# EAGLE design 124_micamp (EAGLE 9.6.2)
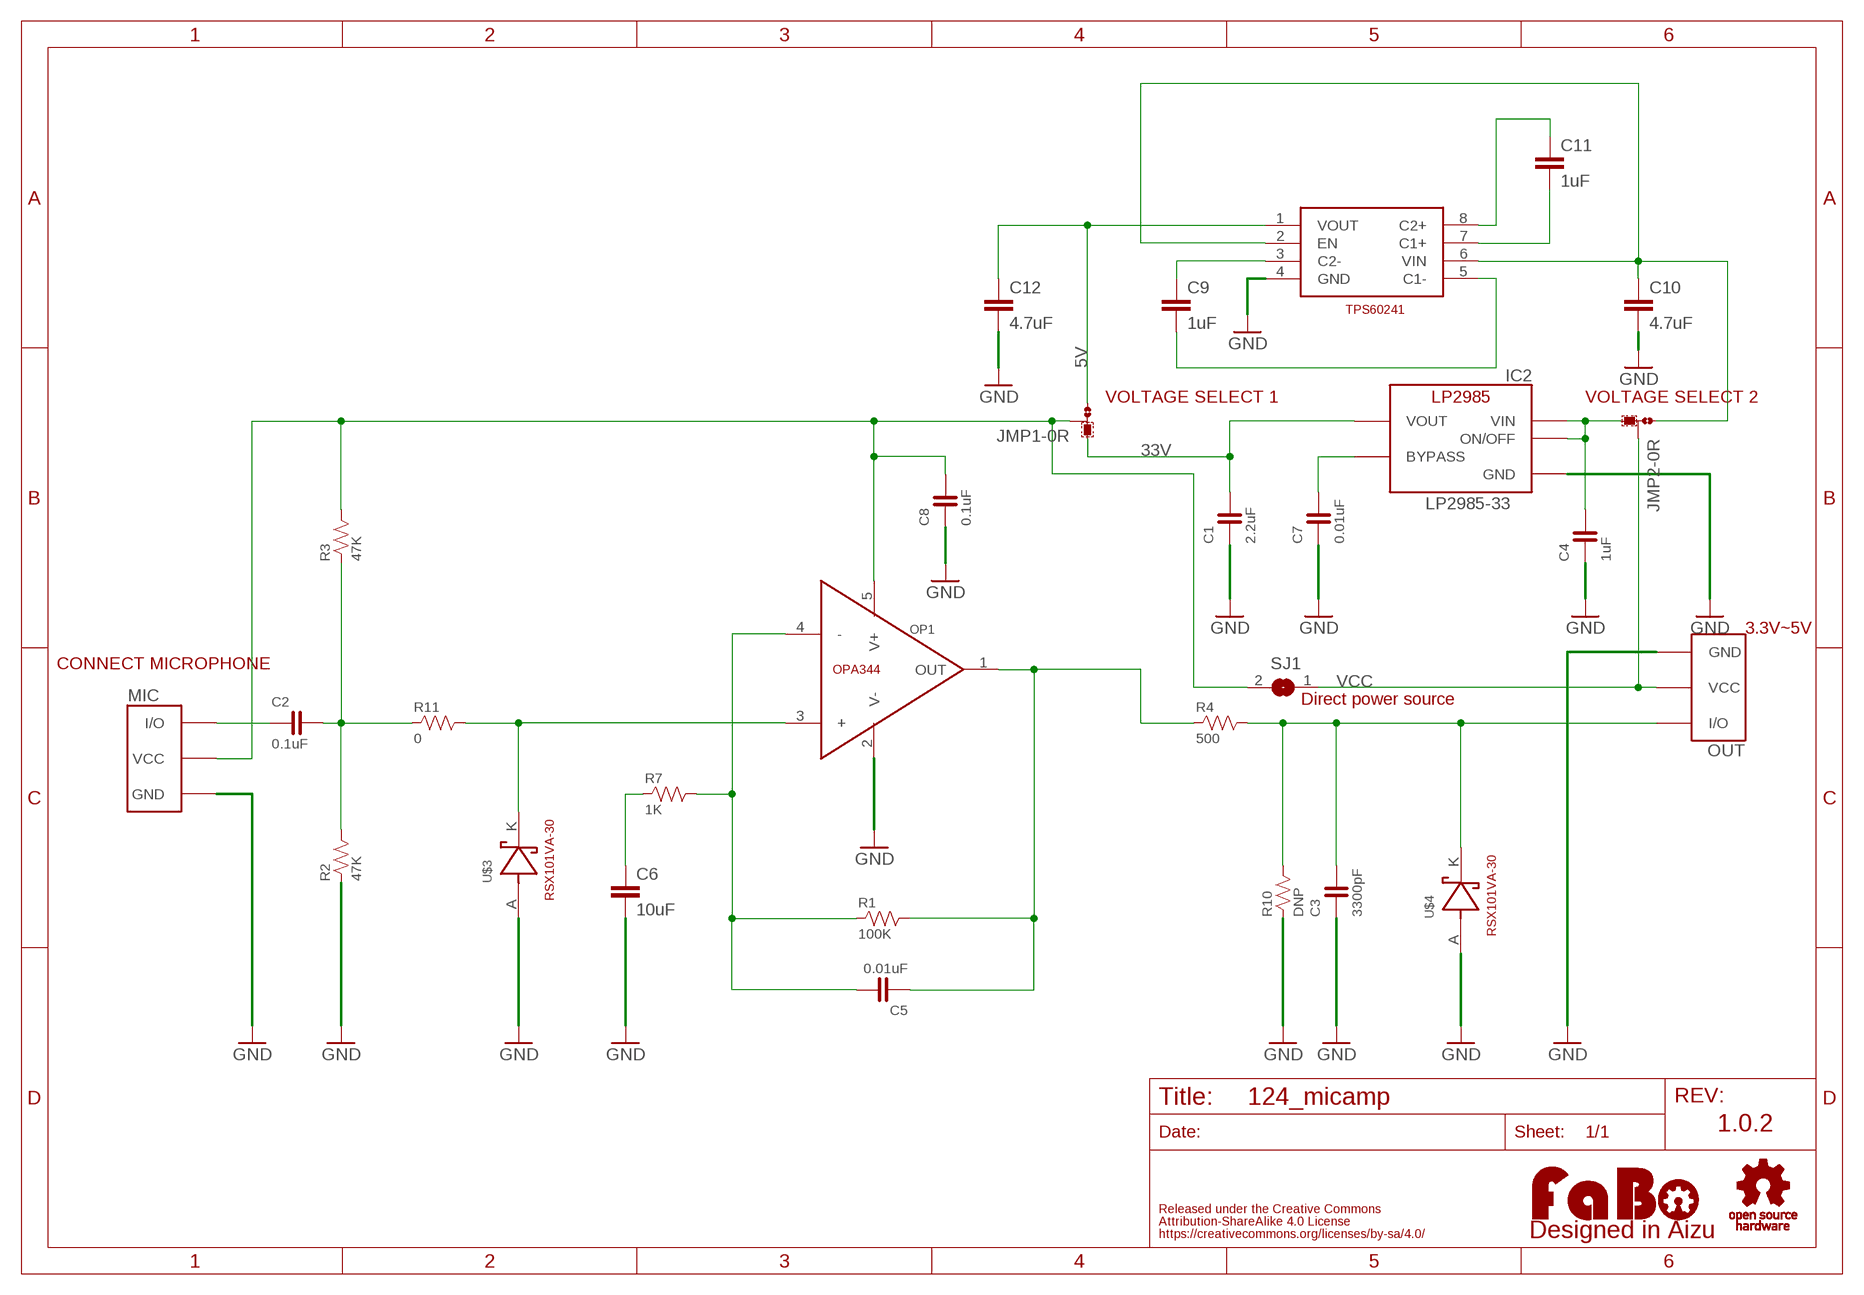
[diagram p0: schematic, sheet 1]

## Parts
C1  2.2uF  CAPACITOR-0603  [0603]
C2  0.1uF  CAPACITOR-0603  [0603]
C3  3300pF  CAPACITOR-0603  [0603]
C4  1uF  CAPACITOR-0603  [0603]
C5  0.01uF  CAPACITOR-0603  [0603]
C6  10uF  C-EUC1206K  [C1206K]
C7  0.01uF  CAPACITOR-0603  [0603]
C8  0.1uF  CAPACITOR-0603  [0603]
C9  1uF  C-EUC2012  [C2012]
C10  4.7uF  C-EUC2012  [C2012]
C11  1uF  C-EUC2012  [C2012]
C12  4.7uF  C-EUC2012  [C2012]
IC2  LP2985-33  LP2985-33DBV  [SOT-23-5]
JMP1  0R-JUMPA  [A0R-JMP]
JMP2  0R-JUMPA  [A0R-JMP]
LOGO1  LOGO_FABO-S  [LOGO_FABO_S]
MIC  FABO_BRICK_3PIN-S03B-PASK-2  [FABO_BRICK_3PIN_S03B-PASK-2]
OP1  OPA344  [SOT23-5]
OUT  FABO_BRICK_3PIN-S03B-PASK-2  [FABO_BRICK_3PIN_S03B-PASK-2]
R1  100K  RESISTOR-0603  [0603]
R2  47K  RESISTOR-0603  [0603]
R3  47K  RESISTOR-0603  [0603]
R4  500  RESISTOR-0603  [0603]
R7  1K  RESISTOR-0603  [0603]
R10  DNP  RESISTOR-0603  [0603]
R11  0  RESISTOR-0603  [0603]
SJ1  SJ  [SJ]
U$2  LOGO_OSHW-S_BOTTOM  [LOGO_OSHW_S_BOTTOM]
U$3  RSX101VA-30  [RSX101VA-30]
U$4  RSX101VA-30  [RSX101VA-30]
U$5  TPS60241(VSSOP8)  [VSSOP8]

## Nets
5V: C12.1 JMP1.3 U$5.1(VOUT)
33V: C1.2 IC2.5(VOUT) JMP1.1
GND: C1.1 C3.1 C4.1 C6.2 C7.1 C8.1 C10.2 C12.2 IC2.2(GND) MIC.GND OP1.2(V-) OUT.GND R2.1 R10.1 U$3.A(ANODE) U$4.A(ANODE) U$5.4(GND)
N$1: OP1.3(+) R11.2 U$3.K(CATHODE)
N$2: C2.1 MIC.I/O
N$4: C5.2 OP1.4(-) R1.1 R7.2
N$6: C6.1 R7.1
N$7: C5.1 OP1.1(OUT) R1.2 R4.1
N$8: C7.2 IC2.4(BYPASS)
N$9: C2.2 R2.2 R3.1 R11.1
N$10: C3.2 OUT.I/O R4.2 R10.2 U$4.K(CATHODE)
N$14: C9.1 U$5.3(C2-)
N$15: C9.2 U$5.5(C1-)
N$16: C11.1 U$5.8(C2+)
N$17: C11.2 U$5.7(C1+)
N$18: C10.1 JMP2.1 U$5.2(EN) U$5.6(VIN)
N$19: C4.2 IC2.1(VIN) IC2.3(ON/OFF) JMP2.3
VCC: JMP2.2 OUT.VCC SJ1.1
VCC_ON: C8.2 JMP1.2 MIC.VCC OP1.5(V+) R3.2 SJ1.2

## Notes on the sheet
- VOLTAGE SELECT 1 | VOLTAGE SELECT 2
- LP2985-33
- 3.3V~5V
- CONNECT MICROPHONE
- Direct power source
- 1.0.2

## Library data of the parts
C1 C4 C5 C7 C8 = FaBo-Capacitor:CAPACITOR: CAPACITOR
C2 C3 = FaBo-Capacitor:CAPACITOR: CAPACITOR; SPICEPREFIX: C
C6 C9-C12 = rcl:C-EU: CAPACITOR, European symbol; SPICEPREFIX: C
IC2 = FaBo-Supply:LP2985: LP2985
JMP1 JMP2 = jump-0r-smd:0R-JUMP: SMD 0R 0805 Jumper
LOGO1 = component:LOGO_FABO
MIC OUT = FaBo-Template:FABO_BRICK_3PIN: FaBo Brick 3pin
OP1 = FaBo-Opamp:OPA344
R1-R4 R7 R10 R11 = FaBo-Resistors:RESISTOR: RESISTOR
SJ1 = jumper:SJ: SMD solder JUMPER
U$2 = component:LOGO_OSHW
U$3 U$4 = FaBo-Diode:RSX101VA-30
U$5 = FaBo-Supply:TPS60241(VSSOP8)

## Board
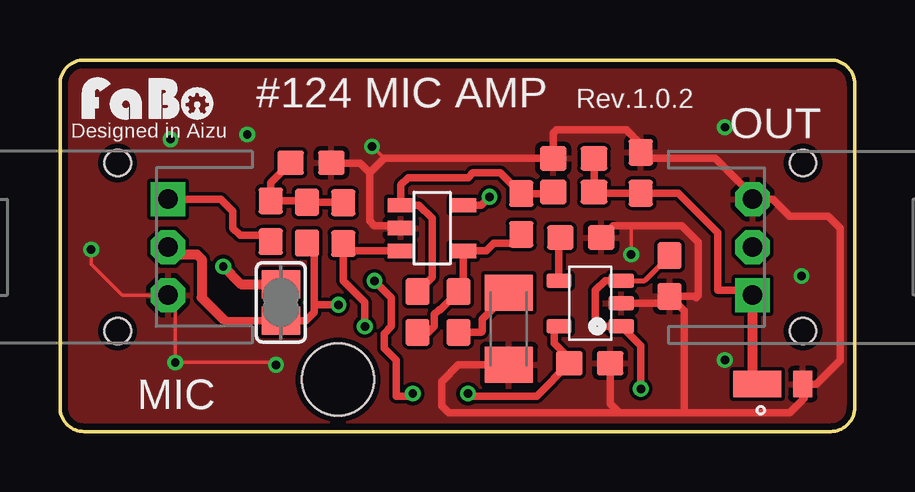
[diagram p1: board, top side]
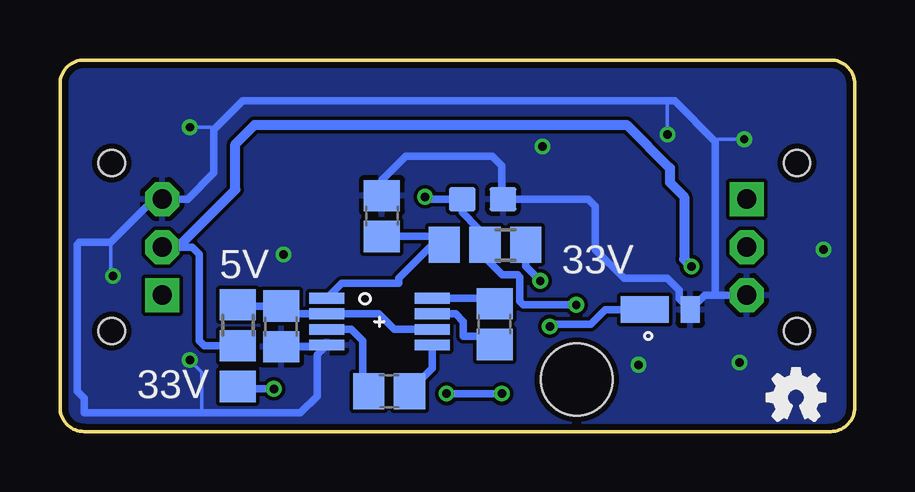
[diagram p2: board, bottom side, seen from below]

Size 33.11 x 15.48 mm. Coordinates in mm from the lower left corner, seen from the top.
Outline: 32.11,0 1,0 arc-90 0,1 0,14.48 arc-90 1,15.48 32.11,15.48 arc-90 33.11,14.48 33.11,1 arc-90 32.11,0
Copper layers (1*16): Top 0.035mm / dielectric 1.6mm / Bottom 0.035mm
Design rules "PCBway": minimum track width 6mil, minimum drill 12mil, track to track 6mil, track to pad 6mil, pad to pad 6mil, via to via 6mil, smd to smd 6mil, copper to edge 10mil, drill to drill 10mil, minimum pad ring 10mil, minimum via ring 6mil, stop-mask expansion 2mil, vias tented up to drill 100mil, thermal gap 8mil
Holes 3 mm at 11.58,2.16

### Footprints (pad centres in the part's own frame; a part is rotated, then mirrored left to right if it is on the bottom)
0603 = smd 1.1 x 1: 1 -0.85,0; 2 0.85,0
C1206K = smd 1.5 x 2: 1 -1.5,0; 2 1.5,0
C2012 = smd 1.3 x 1.5: 1 -0.85,0; 2 0.85,0
SOT-23-5 = smd 0.6 x 1.05: 1 -0.95,-1.3; 2 0,-1.3; 3 0.95,-1.3; 4 0.95,1.3; 5 -0.95,1.3
A0R-JMP = smd 1.5 x 1.3: 1 0,1.7; 2 0,0; 3 0,-1.7
FABO_BRICK_3PIN_S03B-PASK-2 = drill 0.8 pad 1.422 octagon: GND -2,0; VCC 0,0 | drill 0.8 pad 1.422 square: I/O 2,0 | hole 1.1: 3.5,2.1; -3.5,2.1
SOT23-5 = smd 0.6 x 1.1: 1 -0.95,-1.3; 2 0,-1.3; 3 0.95,-1.3; 4 0.95,1.3; 5 -0.95,1.3
SJ = smd 1.168 x 1.6: 1 -0.762,0; 2 0.762,0
RSX101VA-30 = smd 1.1 x 0.8: A 0,-1.25 | smd 1.1 x 2: K 0,0.65
VSSOP8 = smd 0.45 x 1.45: 1 -0.975,-2.2; 2 -0.325,-2.2; 3 0.325,-2.2; 4 0.975,-2.2; 5 0.975,2.2; 6 0.325,2.2; 7 -0.325,2.2; 8 -0.975,2.2

### Placement (x,y rotation side)
C1  22.07,2.84 180 top
C2  8.79,8.76 90 top
C3  24.2,10.78 270 top
C4  25.4,6.48 90 top
C5  14.9,4.98 270 top
C6  18.7,4.28 270 top
C7  21.7,8.08 180 top
C8  15.5,9.68 180 bottom
C9  19.4,1.68 0 bottom
C10  23.9,4.38 270 bottom
C11  15,4.48 270 bottom
C12  19.7,8.98 90 bottom
IC2  22.09,5.34 90 top
JMP1  15.4,7.78 270 bottom
JMP2  25.7,3.58 0 bottom
LOGO1  3.71,12.85 0 top
MIC  4.5,7.68 90 top
OP1  15.5,8.48 270 top
OUT  28.85,7.68 270 top
R1  19.21,9.07 90 top
R2  10.46,11.2 180 top
R3  10.29,8.7 270 top
R4  21.4,9.98 0 top
R7  16.6,4.98 90 top
R10  21.4,11.38 0 top
R11  11.8,8.68 270 top
SJ1  9.2,5.38 270 top
U$2  2.44,1.42 0 top
U$3  8.1,5.08 90 bottom
U$4  29.7,1.98 90 top
U$5  19.8,4.58 270 bottom

### Tracks (layer width: path | path; a pad name or v marks a point on that pad's centre or on a via)
5V
  Bottom 0.305: 19.85,7.98 C12.1 17.45,8.13 JMP1.3 17.6,7.78 19,6.38 19,6.18 21.38,6.18 U$5.1
33V  (via drill 0.35)
  Top 0.2: IC2.5 20.49,4.39
  Top 0.305: IC2.5 20.6,4.2 20.6,3.68 21.22,3.06 C1.2 19.85,1.48 17.1,1.48 v17,1.58 | v13.1,6.28 13.8,5.58 13.8,5.28 13.8,4.38 13.5,4.08 13.5,3.48 14,2.98 14,1.48 14.6,1.48 v14.7,1.58
  Bottom 0.305: v13.1,6.28 13.7,6.88 JMP1.1 | v17,1.58 v14.7,1.58
GND  (via drill 0.35)
  Top 0.152: v13,11.88 13.5,11.38 | v1.3,7.58 1.3,6.98 2.59,5.68 MIC.GND 4.8,5.38 v4.8,2.88 8.9,2.88 v9,2.78 | v23.8,7.38 23.8,8.58
  Top 0.305: U$4.A 31.5,1.98 32.5,2.98 32.5,8.48 32,8.98 30.4,8.98 29.7,9.68 OUT.GND 28.85,9.82 27.3,11.38 24.45,11.38 C3.1 24.2,11.98 23.6,12.58 20.7,12.58 20.55,12.43 R10.1 13.5,11.38 12.9,10.78 | 30.8,1.93 30.85,1.98 U$4.A | OP1.2 14.1,8.58 13.1,8.58 12.9,8.78 12.9,10.78 | R2.1 11.33,11.18 12.5,11.18 12.9,10.78 | IC2.2 25.11,5.34 C4.1 | U$4.A 30.95,1.43 31,1.38 30.4,0.78 26,0.78 | C6.2 16.6,2.78 15.9,2.08 15.9,1.08 16.2,0.78 23.3,0.78 | 26,0.78 23.3,0.78 | C7.1 23.05,8.58 23.8,8.58 25.9,8.58 26.6,7.88 26.6,5.68 26.5,5.58 26.45,5.63 C4.1 | C4.1 26,5.03 26,0.78 | C1.1 22.92,1.16 23.3,0.78
  Bottom 0.152: v4.6,12.18 5.7,12.18 5.8,12.08 | v27.7,12.68 26.82,12.68 26.71,12.57 | v27.7,2.98 27.2,2.48 27.2,0.78 | v30.9,6.48 31,6.58 31,7.88 | v7.8,12.38 7.8,13.68 7.7,13.78
  Bottom 0.305: U$3.A 6.25,5.68 5.8,5.68 | 5.8,5.68 MIC.GND | 6.85,5.33 U$3.A | 5.8,5.68 5.8,12.08 7.5,13.78 7.7,13.78 25.5,13.78 26.71,12.57 26.71,10.77 27.79,9.68 OUT.GND 29.2,9.68 31,7.88 32.3,7.88 32.4,7.78 32.4,1.68 32.1,1.38 32.1,0.78 27.2,0.78 23.1,0.78 22.4,1.48 22.4,3.21 U$5.4 22.07,3.53 C10.2 | C12.2 19.7,10.48 18.7,11.48 15.1,11.48 14.7,11.08 14.7,9.73 C8.1 11.1,9.68 10.8,9.38 10.8,7.58 9.6,6.38 7.8,6.38 7.3,5.88 7.3,5.53 U$3.A
  pour Top: 0,15.48 0,-0.4 33.02,-0.4 33.02,15.48
  pour Bottom: 0,15.48 0,-0.4 33.02,-0.4 33.02,15.48
N$1  (via drill 0.35)
  Top 0.305: OP1.3 12.1,7.53 R11.2 | R11.2 11.5,7.53 | R11.2 11.8,6.28 12.7,5.38 v12.7,4.38
  Bottom 0.305: v12.7,4.38 12.6,4.48 11,4.48 10.4,5.08 | 10.4,5.08 U$3.K | 10.4,5.08
N$2
  Top 0.254: 8.76,7.89 C2.1
  Top 0.305: MIC.I/O 6.7,9.68 7.2,9.18 7.2,8.48 7.5,8.18 8.46,8.18 8.76,7.89
N$4
  Top 0.305: R1.1 18.83,7.83 18.07,7.83 17.77,7.53 OP1.4 16.8,6.03 R7.2 15.85,5.08 15.8,5.08 15.6,4.88 15.6,4.38 15.35,4.13 C5.2
N$6
  Top 0.305: C6.1 17.6,4.68 17.6,4.18 17.55,4.13 R7.1
N$7
  Top 0.305: 20.2,9.63 R4.1 20.48,9.91 R1.2 18.35,10.78 17.2,10.78 17,10.58 14.5,10.58 14.2,10.28 OP1.1 14.95,9.43 15.5,8.88 15.5,8.38 15.5,6.43 C5.1
N$8
  Top 0.305: IC2.4 20.79,8.02 C7.2
N$9
  Top 0.305: 10.24,9.61 C2.2 8.79,10.38 R2.2 | 10.24,9.61 R3.1 11.78,9.55 R11.1 | 10.26,9.64 10.24,9.61
N$10
  Top 0.305: 22.45,11.18 R10.2 R4.2 22.3,9.93 C3.2 25.75,9.93 27.4,8.28 27.4,5.88 28.66,5.88 OUT.I/O
  Top 0.406: U$4.K 28.85,2.17 OUT.I/O
N$14
  Bottom 0.305: C9.1 20.5,1.93 20.5,3.78 20.97,4.25 U$5.3
N$15
  Bottom 0.305: C9.2 17.6,2.63 U$5.5
N$16
  Bottom 0.305: U$5.8 15.22,5.55 C11.1
N$17
  Bottom 0.203: 15.35,3.63 C11.2
  Bottom 0.305: C11.2 15.35,3.98 16.3,3.98 16.3,4.58 16.62,4.91 U$5.7
N$18
  Bottom 0.305: JMP2.1 25.65,5.23 C10.1 23.57,4.91 U$5.2 19.82,4.91 19.17,4.25 U$5.6
N$19  (via drill 0.35)
  Top 0.2: C4.2 24.36,6.29 IC2.3
  Top 0.305: v24.2,1.78 24.2,3.58 IC2.1 22.51,4.39 22.5,4.38 22.3,4.58 22.3,5.88 22.71,6.29 IC2.3
  Bottom 0.2: JMP2.3 25.4,1.58
  Bottom 0.305: JMP2.3 25.6,1.78 v24.2,1.78
VCC  (via drill 0.35)
  Top 0.406: v6.8,6.88 7.54,6.14 SJ1.1
  Bottom 0.305: JMP2.2 27.1,3.58 27.3,3.78 27.3,7.38 27.6,7.68 OUT.VCC
  Bottom 0.406: OUT.VCC 28.2,7.68 25.8,10.08 25.8,11.98 25,12.78 9.5,12.78 7.7,10.98 7.7,10.38 7.1,9.78 7.1,7.18 v6.8,6.88
VCC_ON  (via drill 0.35)
  Top 0.305: 6.8,4.68 6.86,4.62 SJ1.2 10.24,4.62 10.6,4.98 10.6,5.28 | R3.2 10.6,7.54 10.6,5.28 | v17.9,9.78 17.55,9.43 OP1.5 | v11.6,5.28 10.6,5.28
  Top 0.406: MIC.VCC 4.81,7.38 5.7,7.38 5.9,7.18 5.9,5.58 6.8,4.68
  Bottom 0.305: v17.9,9.78 17.8,9.68 C8.2 16.35,9.13 15.7,8.48 15.7,8.08 JMP1.2 15.4,7.25 14.68,6.52 14.04,6.52 13.95,6.42 13.95,5.42 13.8,5.28 v11.6,5.28

### Text on the board
tPlace: #124 MIC AMP | Rev.1.0.2 | Designed in Aizu
bPlace: 33V | 5V | 33V